# EasyEDA Pro project LEAP_ROS.epro, schematic LEAP_ROS

## Sheets
1 P1: Assembly Variant: Basic; Board Name: Board1; Create Date: 2026-04-24; Page Name: P1; Project Name: 四驱v2核心板; Schematic Name: Schematic1; Update Date: 2026-04-24; Company: 嘉立创EDA; Page Size: A4; Version: V1.0
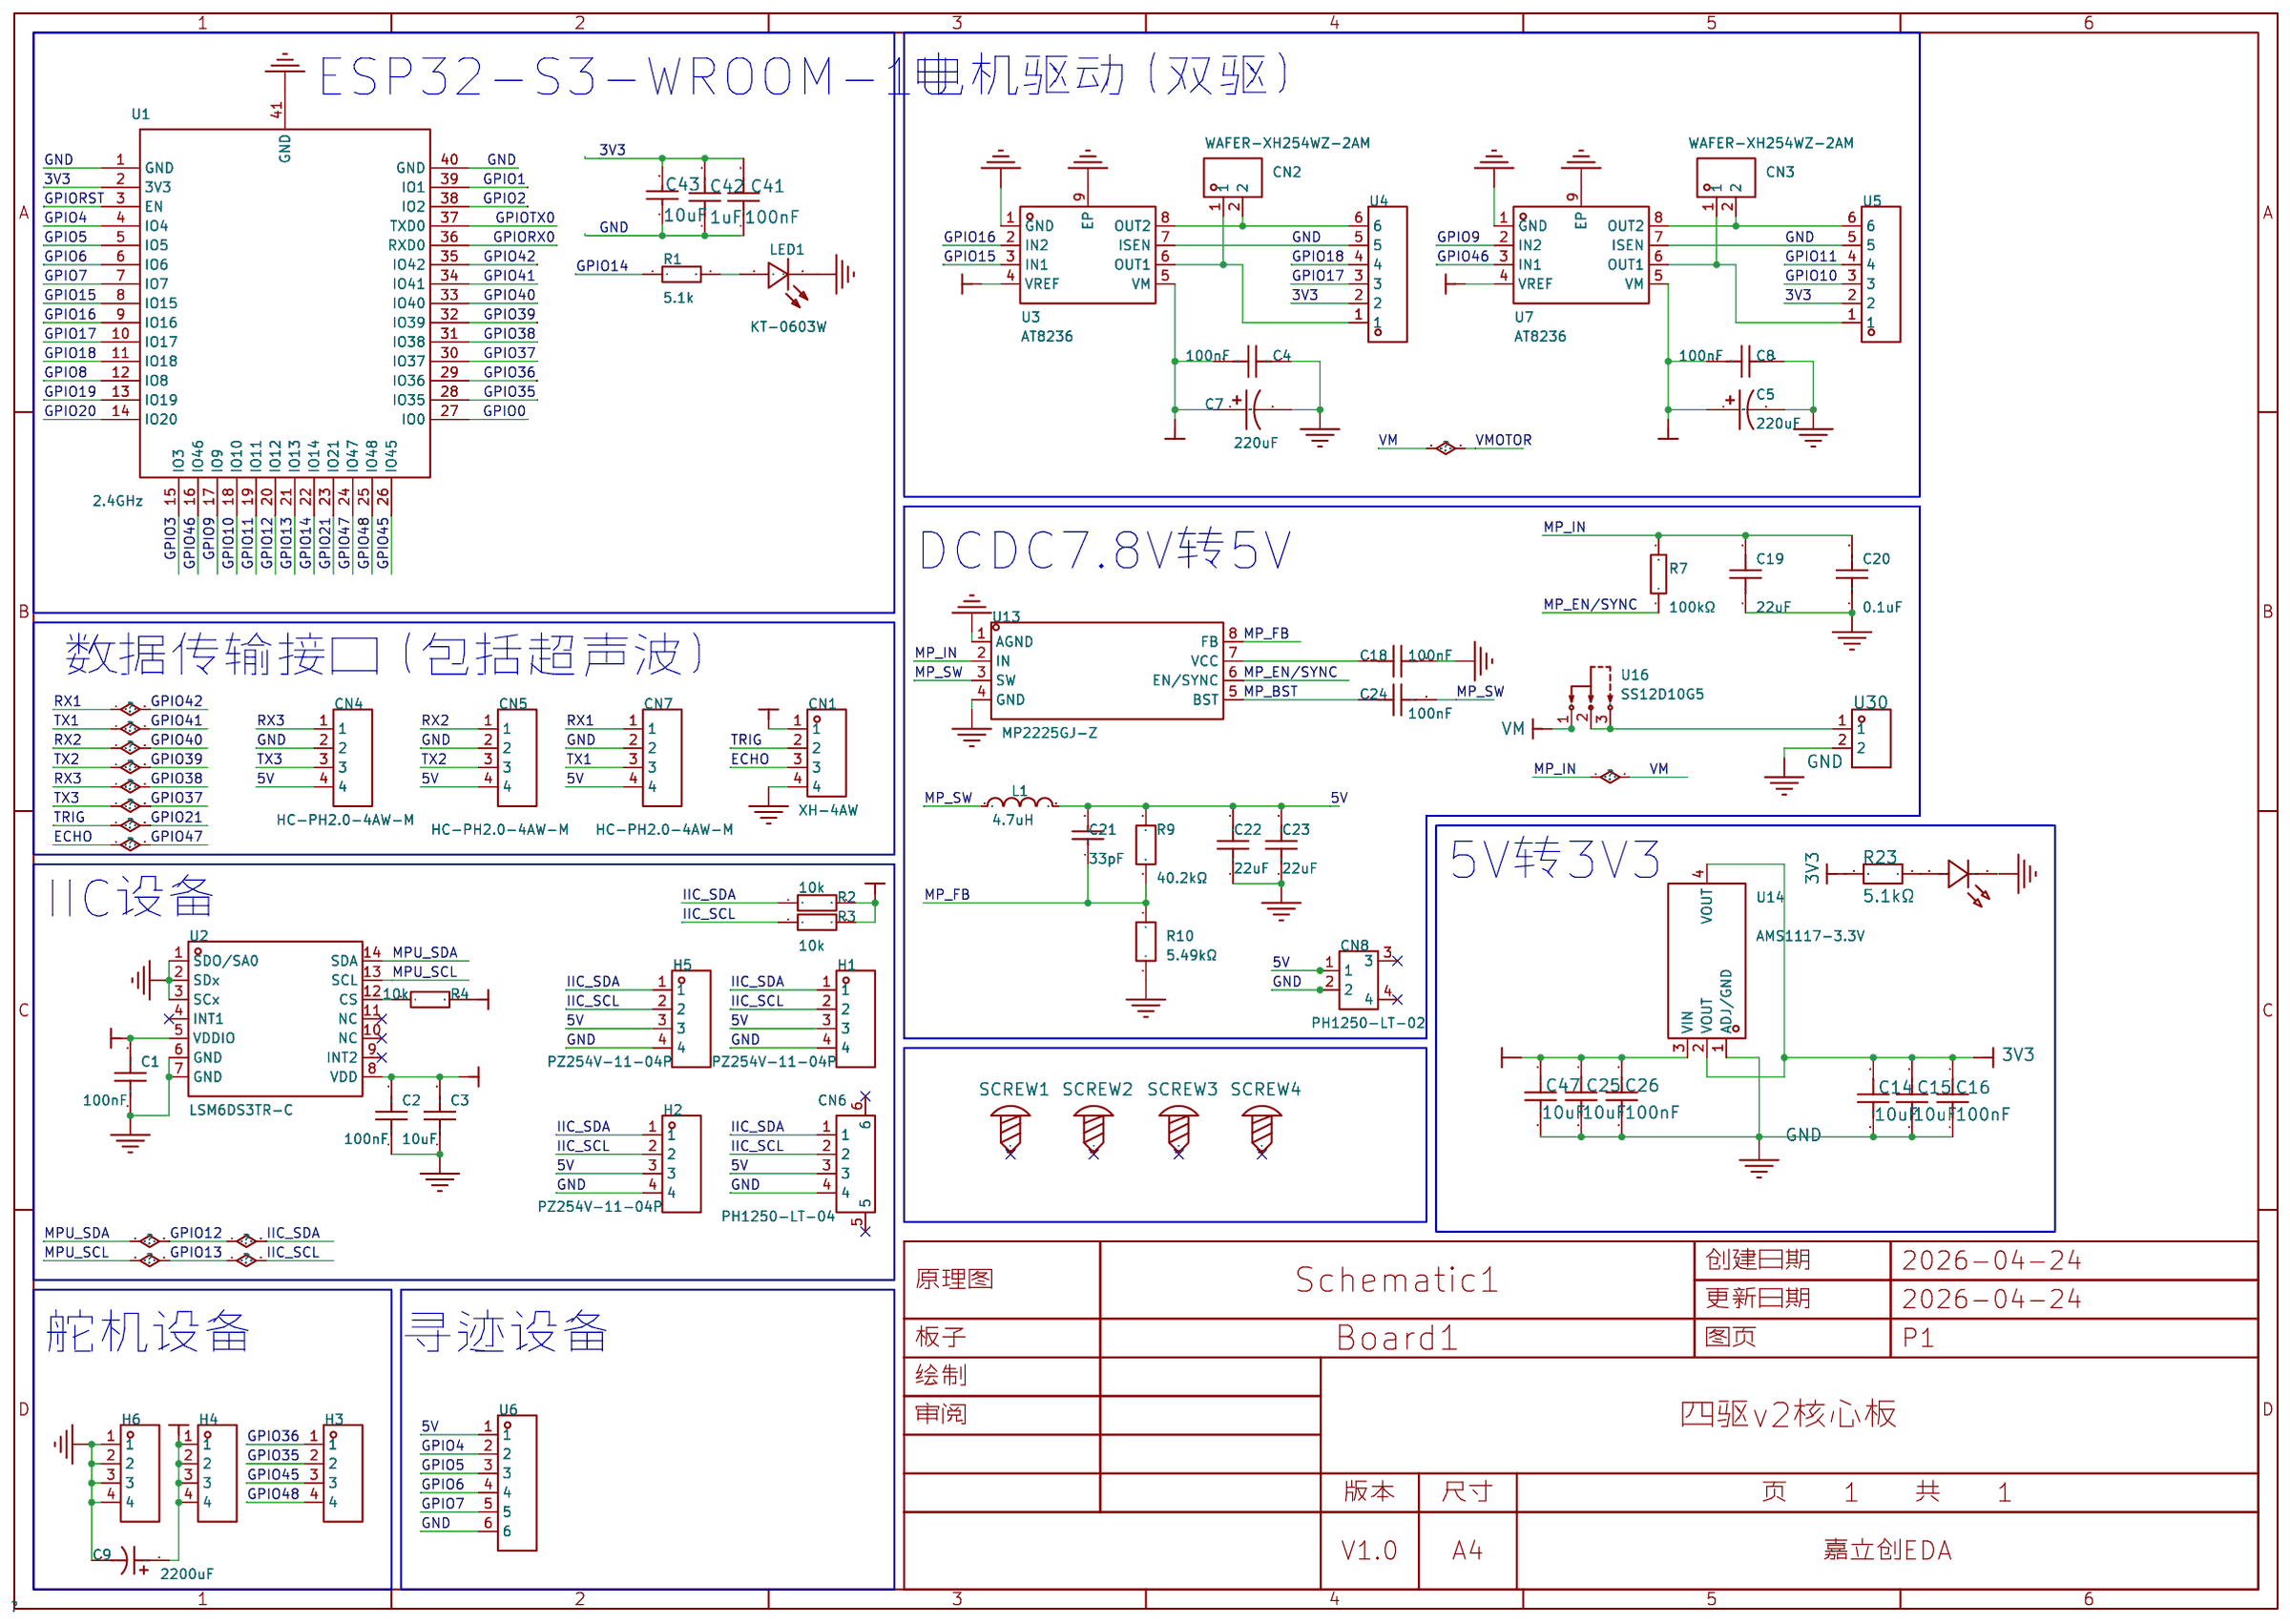
[diagram p0: P1]
2 P2: Page Name: P2
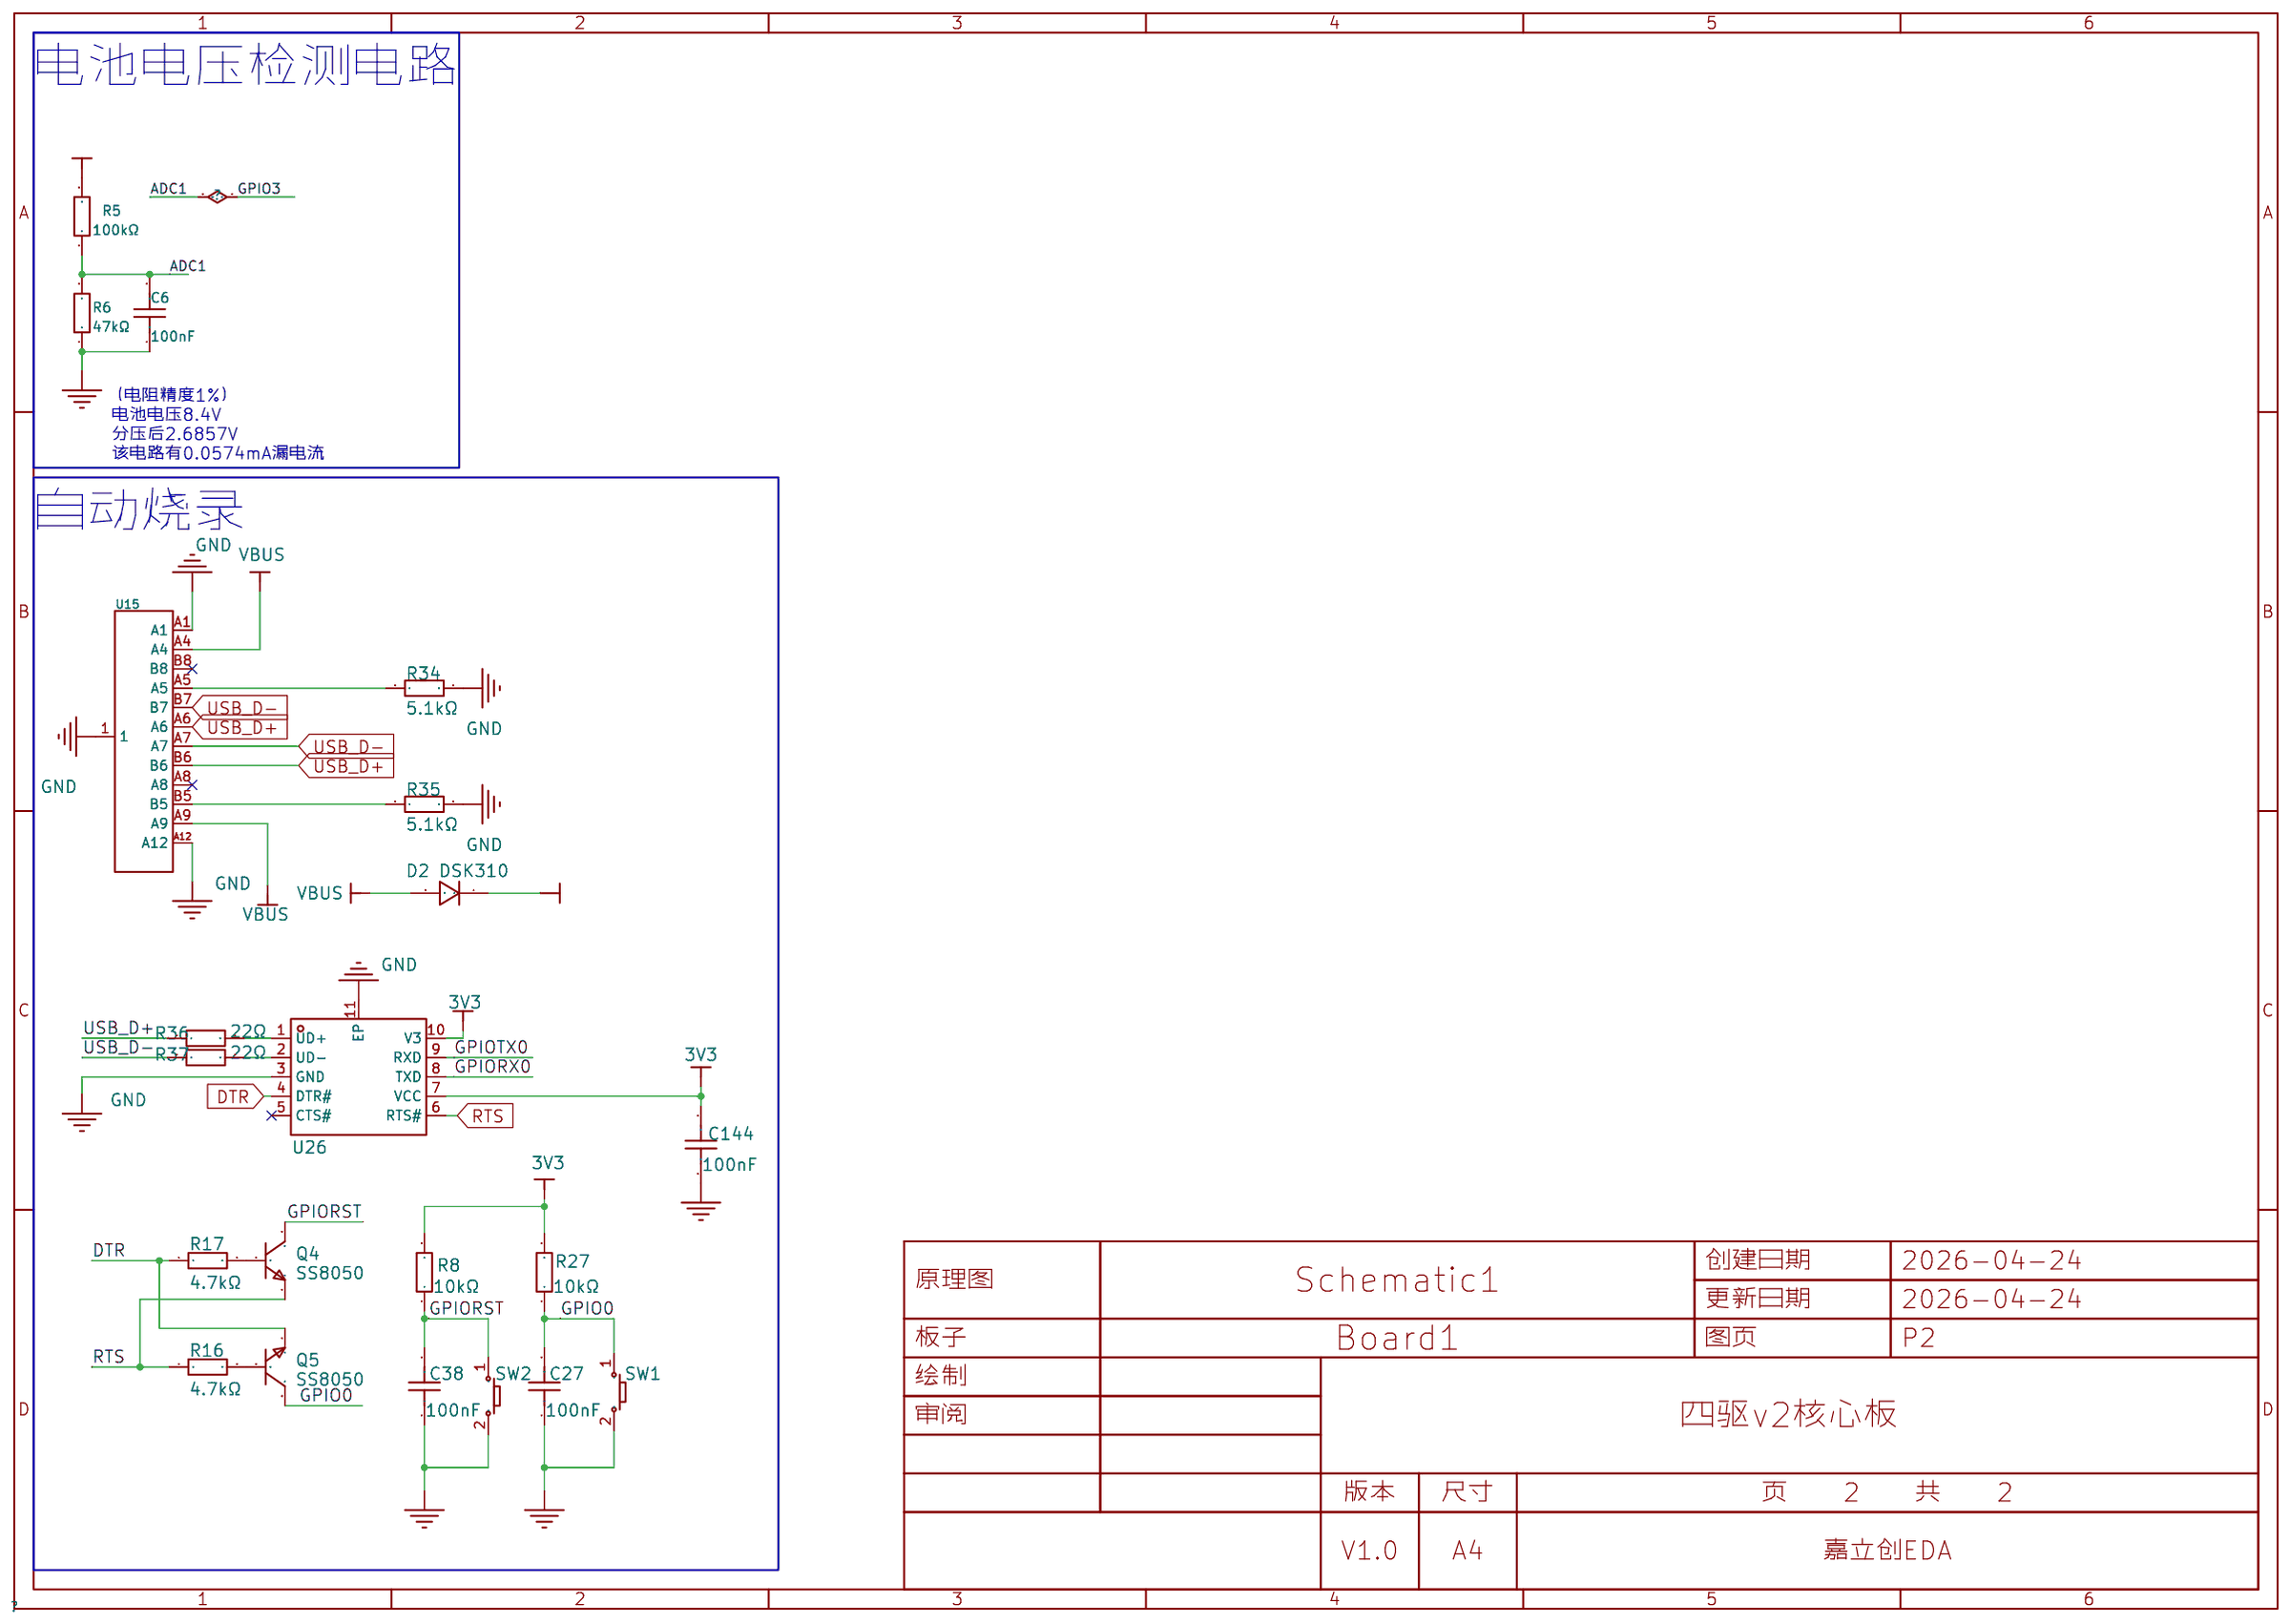
[diagram p1: P2]

## Parts
sheet P1
C1  100nF  [C0603]
C2  100nF  [C0603]
C3  10uF  [C0603]
C4  100nF  [C0603]
C5  220uF  [CAP-TH_BD6.3-P2.50-D0.6-FD-1]
C7  220uF  [CAP-TH_BD6.3-P2.50-D0.6-FD-1]
C8  100nF  [C0603]
C9  2200uF  [CAP-TH_BD10.0-P5.00-D0.6-FD]
C14  10uF  [C0603]
C15  10uF  [C0603]
C16  100nF  [C0603]
C18  100nF  [C0603]
C19  22uF  [C0603]
C20  0.1uF  [C0603]
C21  33pF  [C0603]
C22  22uF  [C0603]
C23  22uF  [C0603]
C24  100nF  [C0603]
C25  10uF  [C0603]
C26  100nF  [C0603]
C41  100nF  [C0603]
C42  1uF  [C0603]
C43  10uF  [C0603]
C47  10uF  [C0603]
CN1  XH-4AW  [CONN-TH_XH-4AW]
CN2  WAFER-XH254WZ-2AM  [CONN-TH_2P-P2.50_WAFER-XH254WZ-2A]
CN3  WAFER-XH254WZ-2AM  [CONN-TH_2P-P2.50_WAFER-XH254WZ-2A]
CN4  HC-PH2.0-4AW-M  [CONN-TH_HC-PH2.0-4AW-M]
CN5  HC-PH2.0-4AW-M  [CONN-TH_HC-PH2.0-4AW-M]
CN6  PH1250-LT-04  [CONN-SMD_PH1250-LT-04]
CN7  HC-PH2.0-4AW-M  [CONN-TH_HC-PH2.0-4AW-M]
CN8  PH1250-LT-02  [CONN-SMD_2P-P1.25_PH1250-LT-02]
H1  PZ254V-11-04P  [HDR-TH_4P-P2.54-V-M]
H2  PZ254V-11-04P  [HDR-TH_4P-P2.54-V-M]
H3  PZ254V-11-04P  [HDR-TH_4P-P2.54-V-M]
H4  PZ254V-11-04P  [HDR-TH_4P-P2.54-V-M]
H5  PZ254V-11-04P  [HDR-TH_4P-P2.54-V-M]
H6  PZ254V-11-04P  [HDR-TH_4P-P2.54-V-M]
L1  4.7uH  [IND-SMD_L7.0-W6.6]
LED1  KT-0603W  [LED0603-R-RD_WHITE]
LED5  XL-1608SURC-06  [LED0603-RD_RED]
R1  5.1k  [R0603]
R2  10k  [R0603]
R3  10k  [R0603]
R4  10k  [R0603]
R7  100kΩ  [R0603]
R9  40.2kΩ  [R0603]
R10  5.49kΩ  [R0603]
R23  5.1kΩ  [R0603]
SCREW1  -  [M2螺丝]
SCREW2  -  [M2螺丝]
SCREW3  -  [M2螺丝]
SCREW4  -  [M2螺丝]
U1  2.4GHz  [WIRELM-SMD_ESP32-S3-WROOM-1U]
U2  LSM6DS3TR-C  [LGA-14_L3.0-W2.5-P0.50-TL]
U3  AT8236  [ESOP-8_L4.9-W3.9-P1.27-LS6.0-BL-EP]
U4  ZX-XH2.54-6PWZ  [CONN-TH_6P-P2.50_ZX-XH2.54-6PWZ]
U5  ZX-XH2.54-6PWZ  [CONN-TH_6P-P2.50_ZX-XH2.54-6PWZ]
U6  ZX-XH2.54-6PWZ  [CONN-TH_6P-P2.50_ZX-XH2.54-6PWZ]
U7  AT8236  [ESOP-8_L4.9-W3.9-P1.27-LS6.0-BL-EP]
U13  MP2225GJ-Z  [TSOT-23-8_L2.9-W1.6-P0.65-LS2.8-BR]
U14  AMS1117-3.3V  [SOT-223-4_L6.5-W3.5-P2.30-LS7.0-TR]
U16  SS12D10G5  [SW-TH_SHOU-HAN_SS12D10G4]
U30  KH-A2504-02AW  [CONN-TH_2P-P2.50_KH-A2504-02AW]
sheet P2
C6  100nF  [C0603]
C27  100nF  [C0603]
C38  100nF  [C0603]
C144  100nF  [C0603]
D2  DSK310  [SOD-123FL_L2.8-W1.9-LS3.7-RD]
Q4  SS8050  [SOT-23-3_L2.9-W1.3-P1.90-LS2.4-BR]
Q5  SS8050  [SOT-23-3_L2.9-W1.3-P1.90-LS2.4-BR]
R5  100kΩ  [R0603]
R6  47kΩ  [R0603]
R8  10kΩ  [R0603]
R16  4.7kΩ  [R0603]
R17  4.7kΩ  [R0603]
R27  10kΩ  [R0603]
R34  5.1kΩ  [R0603]
R35  5.1kΩ  [R0603]
R36  22Ω  [R0603]
R37  22Ω  [R0603]
SW1  TSA016A2518A  [KEY-SMD_4P-L4.2-W3.4-P2.15-LS4.5-TL]
SW2  TSA016A2518A  [KEY-SMD_4P-L4.2-W3.4-P2.15-LS4.5-TL]
U15  USB-TYPE-C-019  [TYPE-C-SMD_HX-TYPE-C-16PIN]
U26  CH340K  [ESOP-10_L4.9-W3.9-P1.00-LS6.2-BL-EP]

## Library data of the parts
C1-C4 C6 C8 C18-C20 C24 = CGA0603X7R104K500JT: 容值:100nF;精度:±10%;额定电压:50V;温度系数:X7R;; LCSC Part Name: 100nF ±10% 50V; Supplier Part: C6119867; Manufacturer: HRE(芯声); Supplier Footprint: 0603; JLCPCB Part Class: Extended Part; Datasheet: https://item.szlcsc.com/datasheet/CGA0603X7R104K500JT/7062573.html; Supplier: LCSC; Tolerance: ±10%; Voltage Rating: 50V; Temperature Coefficient: X7R
C5 C7 = KNH2220UF35V149EC0020: 容值:220uF;精度:±20%;额定电压:35V;纹波电流:1.7A@100kHz;等效串联电阻(ESR):40mΩ@100kHz;; LCSC Part Name: 220uF ±20% 35V; Supplier Part: C2944314; Manufacturer: KNSCHA(科尼盛); Supplier Footprint: 插件,D6.3xL12mm; JLCPCB Part Class: Extended Part; Datasheet: https://item.szlcsc.com/datasheet/KNH2220UF35V149EC0020/3330329.html; Supplier: LCSC; Tolerance: ±20%; Voltage Rating: 35V; Ripple Current: 1.7A@100kHz; Equivalent Series Resistance(ESR): 40mΩ@100kHz; Pin Spacing: 2.5mm; Diameter: 6.3mm; Height - Seated (Max): 12mm; Lifetime: 2000hrs@105℃; Operating Temperature: -55℃~+105℃
C9 = ERA10V2200M10X16: 容值:2200uF;精度:±20%;额定电压:10V;纹波电流:886mA@120Hz;; LCSC Part Name: 2200uF ±20% 10V; Supplier Part: C49256788; Manufacturer: JIERR(捷而瑞); Supplier Footprint: 插件,D10xL16mm; JLCPCB Part Class: Extended Part; Datasheet: https://item.szlcsc.com/datasheet/ERA10V2200M10X16/51692188.html; Supplier: LCSC; Tolerance: ±20%; Voltage Rating: 10V; Ripple Current: 886mA@120Hz; Pin Spacing: 5mm; Diameter: 10mm; Height - Seated (Max): 16mm; Lifetime: 2000hrs@105℃; Operating Temperature: -40℃~+105℃
C14 C15 C25 C47 = CL10A106MA8NRNC: LCSC Part Name: 10uF ±20% 25V; Supplier Part: C96446; Manufacturer: SAMSUNG(三星); Supplier Footprint: 0603; JLCPCB Part Class: Basic Part; Datasheet: https://atta.szlcsc.com/upload/public/pdf/source/20160218/1457707763339.pdf; Supplier: LCSC; Tolerance: ±20%; Voltage Rated: 25V; Temperature Coefficient: X5R
C16 C26 C41 C144 = CGA0603X7R104K500JT: LCSC Part Name: 100nF ±10% 50V; Supplier Part: C6119867; Manufacturer: HRE(芯声); Supplier Footprint: 0603; JLCPCB Part Class: Extended Part; Datasheet: https://atta.szlcsc.com/upload/public/pdf/source/20250103/C44077DA9E7B3EFAE02F22B6D3D1CBC9.pdf; Supplier: LCSC; Tolerance: ±10%; Voltage Rating: 50V; Temperature Coefficient: X7R
C21 = CC0603JRNPO9BN330: 容值:33pF;精度:±5%;额定电压:50V;温度系数:NP0;; LCSC Part Name: 33pF ±5% 50V; Supplier Part: C107047; Manufacturer: YAGEO(国巨); Supplier Footprint: 0603; JLCPCB Part Class: Extended Part; Datasheet: https://item.szlcsc.com/datasheet/CC0603JRNPO9BN330/108263.html; Supplier: LCSC; Tolerance: ±5%; Voltage Rating: 50V; Temperature Coefficient: NP0
C22 C23 = CGA0603X5R226M160JT: 容值:22uF;精度:±20%;额定电压:16V;温度系数:X5R;; LCSC Part Name: 22uF ±20% 16V; Supplier Part: C6119868; Manufacturer: HRE(芯声); Supplier Footprint: 0603; JLCPCB Part Class: Extended Part; Datasheet: https://item.szlcsc.com/datasheet/CGA0603X5R226M160JT/7062574.html; Supplier: LCSC; Tolerance: ±20%; Voltage Rating: 16V; Temperature Coefficient: X5R
C42 = CAP_0603: Supplier Footprint: 0603
C43 = CL10A106MO8NQNC: LCSC Part Name: 10uF ±20% 16V; Supplier Part: C92487; Manufacturer: SAMSUNG(三星); Supplier Footprint: 0603; JLCPCB Part Class: 扩展库; Datasheet: https://item.szlcsc.com/datasheet/CL10A106MO8NQNC/93680.html; Supplier: LCSC; Tolerance: ±20%; Voltage Rating: 16V; Temperature Coefficient: X5R
CN1 = XH-4AW: 插针结构:1x4P;间距:2.54mm;安装方式:弯插;参考系列:XH;总PIN数:4P;排数:1;每排PIN数:4;行距:-;额定电流:3A;触头材质:黄铜;触头镀层:锡;工作温度:-25℃~+85℃;; LCSC Part Name: 1x4P 间距:2.54mm 弯插 系列:XH; Supplier Part: C2908613; Manufacturer: HCTL(华灿天禄); Supplier Footprint: 弯插,P=2.5mm; JLCPCB Part Class: Extended Part; Datasheet: https://item.szlcsc.com/datasheet/XH-4AW/3184384.html; Supplier: LCSC; Pins Structure: 1x4P; Pitch: 2.54mm; Mounting Type: 弯插; Reference Series: XH; Number of Pins: 4P; Number of Rows: 1; Number of PINs Per Row: 4; Current Rating: 3A; Contact Material: 黄铜; Contact Plating: 锡; Operating Temperature: -25℃~+85℃; Voltage Rating: 250V; Plastic Material: PA66; Flame Retardant Rating: UL94V-0; Z-Height of the Board: 5.9mm; Y-Width of Bottom Edge on Board: 7mm
CN2 CN3 = WAFER-XH254WZ-2AM: 插针结构:1x2P;间距:2.54mm;安装方式:弯插;参考系列:XH;总PIN数:2P;排数:1;每排PIN数:2;额定电流:3A;触头材质:黄铜;工作温度:-25℃~+85℃;; LCSC Part Name: 1x2P 间距:2.54mm 弯插 系列:XH; Supplier Part: C22751831; Manufacturer: HANBO(汉博); Supplier Footprint: 弯插,P=2.54mm; JLCPCB Part Class: Extended Part; Datasheet: https://item.szlcsc.com/datasheet/WAFER-XH254WZ-2AM/24478766.html; Supplier: LCSC; Pins Structure: 1x2P; Pitch: 2.54mm; Mounting Type: 弯插; Reference Series: XH; Number of Pins: 2P; Number of Rows: 1; Number of PINs Per Row: 2; Current Rating: 3A; Contact Material: 黄铜; Operating Temperature: -25℃~+85℃; Voltage Rating: 250V; Plastic Material: PA66; Flame Retardant Rating: UL94V-0
CN4 CN5 CN7 = HC-PH2.0-4AW-M: 插针结构:1x4P;间距:2mm;安装方式:弯插;参考系列:PH;总PIN数:4P;排数:1;每排PIN数:4;额定电流:1A;触头材质:铜;触头镀层:锡;工作温度:-25℃~+85℃;; LCSC Part Name: 1x4P 间距:2mm 弯插 系列:PH; Supplier Part: C53454740; Manufacturer: HC(虹成电子); Supplier Footprint: 弯插,P=2mm; JLCPCB Part Class: Extended Part; Datasheet: https://item.szlcsc.com/datasheet/HC-PH2.0-4AW-M/56613746.html; Supplier: LCSC; Pins Structure: 1x4P; Pitch: 2mm; Mounting Type: 弯插; Reference Series: PH; Number of Pins: 4P; Number of Rows: 1; Number of PINs Per Row: 4; Current Rating: 1A; Contact Material: 铜; Contact Plating: 锡; Operating Temperature: -25℃~+85℃; Voltage Rating: 250V; Plastic Material: PA66; Color: 米色; Z-Height of the Board: 4.8mm; X-Length of Bottom Edge on Board (Spacing Line): 10mm; Y-Width of Bottom Edge on Board: 6.1mm
CN6 = PH1250-LT-04: 插针结构:1x4P;间距:1.25mm;安装方式:立贴;参考系列:PH;总PIN数:4P;排数:1;每排PIN数:4;行距:-;额定电流:-;触头材质:黄铜;触头镀层:锡;工作温度:-;; LCSC Part Name: 1x4P 间距:1.25mm 立贴 系列:PH; Supplier Part: C2939428; Manufacturer: HOOYA(皓宇电子); Supplier Footprint: SMD,P=1.25mm; JLCPCB Part Class: Extended Part; Datasheet: https://item.szlcsc.com/datasheet/PH1250-LT-04/3300375.html; Supplier: LCSC; Pins Structure: 1x4P; Pitch: 1.25mm; Mounting Type: 立贴; Reference Series: PH; Number of Pins: 4P; Number of Rows: 1; Number of PINs Per Row: 4; Contact Material: 黄铜; Contact Plating: 锡; Plastic Material: LCP; Color: 米色; Z-Height of the Board: 5.5mm; X-Length of Bottom Edge on Board (Spacing Line): 9.8mm; Y-Width of Bottom Edge on Board: 3.92mm
CN8 = PH1250-LT-02: 插针结构:1x2P;间距:1.25mm;安装方式:立贴;参考系列:PH;总PIN数:2P;排数:1;每排PIN数:2;行距:-;额定电流:-;触头材质:黄铜;触头镀层:锡;工作温度:-;; LCSC Part Name: 1x2P 间距:1.25mm 立贴 系列:PH; Supplier Part: C2939426; Manufacturer: HOOYA(皓宇电子); Supplier Footprint: SMD,P=1.25mm; JLCPCB Part Class: Extended Part; Datasheet: https://item.szlcsc.com/datasheet/PH1250-LT-02/3300373.html; Supplier: LCSC; Pins Structure: 1x2P; Pitch: 1.25mm; Mounting Type: 立贴; Reference Series: PH; Number of Pins: 2P; Number of Rows: 1; Number of PINs Per Row: 2; Contact Material: 黄铜; Contact Plating: 锡; Plastic Material: LCP; Color: 米色; Z-Height of the Board: 5.5mm; X-Length of Bottom Edge on Board (Spacing Line): 7.3mm; Y-Width of Bottom Edge on Board: 3.92mm
H1-H6 = PZ254V-11-04P: 插针结构:1x4P;间距:2.54mm;行距:-;圆针/方针:方针;安装方式:直插;排数:单排;总PIN位数:4P;额定电流:3A;额定电压:250V;配合针长度:6mm;塑高:2.5mm;端接针长度:3mm;触头材质:-;工作温度:-40℃~+105℃;颜色:黑色;; LCSC Part Name: 1x4P 间距:2.54mm 方针 直插; Supplier Part: C2691448; Manufacturer: XFCN(兴飞); Supplier Footprint: 插件,P=2.54mm; JLCPCB Part Class: Extended Part; Datasheet: https://item.szlcsc.com/datasheet/PZ254V-11-04P/2801085.html; Supplier: LCSC; Pin Structure: 1x4P; Pitch: 2.54mm; Circluar Pins/Square Pins: 方针; Mounting Type: 直插; Number of Rows: 单排; Number of Pins: 4P; Current Rating: 3A; Voltage Rating (Max): 250V; Length of Mating Pin: 6mm; Insulation Height: 2.5mm; Length of End Connection Pin: 3mm; Operating Temperature: -40℃~+105℃; Color: 黑色
L1 = MWSA0605S-4R7MT: 电感值:4.7uH;精度:±20%;额定电流:6A;饱和电流(Isat):8A;类型:-;; LCSC Part Name: 4.7uH ±20% 8A; Supplier Part: C408465; Manufacturer: Sunlord(顺络); Supplier Footprint: SMD,7x6.6mm; JLCPCB Part Class: Extended Part; Datasheet: https://item.szlcsc.com/datasheet/MWSA0605S-4R7MT/397817.html; Supplier: LCSC; Tolerance: ±20%; Current Rating: 6A; Current - Saturation(Isat): 8A; DC Resistance(DCR): 29mΩ
LED1 = KT-0603W: 灯头类型:-;发光颜色:白色;正向压降(Vf):2.6V~3.1V;功率:100mW;正向电流:5mA;波长:-;二极管配置:独立二极管;透镜颜色:黄色透镜;色温:-;发光强度:360mcd;发光角度:120°;载带方式:正贴;工作温度:-40℃~+85℃;; LCSC Part Name: 0603 白灯 高亮; Supplier Part: C2290; Manufacturer: KENTO; Supplier Footprint: 0603; JLCPCB Part Class: Basic Part; Datasheet: https://item.szlcsc.com/datasheet/KT-0603W/2663.html; Supplier: LCSC; Illumination Color: 白色; Voltage - Forward(Vf): 2.6V~3.1V; Power(Watts): 100mW; Forward Current: 5mA; Diode Configuration: 独立二极管; Lens Color: 黄色透镜; Luminous Intensity: 360mcd; Viewing Angle: 120°; Mounting Style: 正贴; Operating Temperature: -40℃~+85℃
LED5 = XL-1608SURC-06: Supplier Part: C965799; Manufacturer: XINGLIGHT(成兴光); Supplier Footprint: 0603; Datasheet: https://atta.szlcsc.com/upload/public/pdf/source/20250213/F9766CE804AF391355DCDD48DB3E0DAB.pdf; Supplier: LCSC; Illumination Color: 红色; Voltage - Forward(Vf): 2.3V; Power(Watts): 50mW; Forward Current: 20mA; Wavelength - Dominant: 620nm~630nm; Peak Wavelength: 625nm; Lens Color: 无色透明透镜; Luminous Intensity: 225mcd; Viewing Angle: 120°; Mounting Sytle: 正贴; Operating Temperature: -20℃~+85℃
R1-R4 = Res_0603: Supplier Footprint: 0603
R5 R7 = 0603WAF1003T5E: 电阻类型:厚膜电阻;阻值:100kΩ;精度:±1%;功率:100mW;工作电压:75V;温度系数:±100ppm/℃;; LCSC Part Name: 100kΩ ±1% 100mW 厚膜电阻; Supplier Part: C25803; Manufacturer: UNI-ROYAL(厚声); Supplier Footprint: 0603; JLCPCB Part Class: Basic Part; Datasheet: https://item.szlcsc.com/datasheet/0603WAF1003T5E/26546.html; Supplier: LCSC; Type: 厚膜电阻; Tolerance: ±1%; Power(Watts): 100mW; Voltage-Supply(Max): 75V; Temperature Coefficient: ±100ppm/℃; Operating Temperature: -55℃~+155℃
R9 = FRC0603F4022TS: 电阻类型:厚膜电阻;阻值:40.2kΩ;精度:±1%;功率:100mW;工作电压:75V;温度系数:±100ppm/℃;; LCSC Part Name: 40.2kΩ ±1% 100mW 厚膜电阻; Supplier Part: C2933218; Manufacturer: FOJAN(富捷); Supplier Footprint: 0603; JLCPCB Part Class: Extended Part; Supplier: LCSC; Type: 厚膜电阻; Tolerance: ±1%; Power(Watts): 100mW; Voltage-Supply(Max): 75V; Temperature Coefficient: ±100ppm/℃; Operating Temperature: -55℃~+155℃
R10 = FRC0603F5491TS: 电阻类型:厚膜电阻;阻值:5.49kΩ;精度:±1%;功率:100mW;工作电压:75V;温度系数:±100ppm/℃;; LCSC Part Name: 5.49kΩ ±1% 100mW 厚膜电阻; Supplier Part: C3000723; Manufacturer: FOJAN(富捷); Supplier Footprint: 0603; JLCPCB Part Class: Extended Part; Supplier: LCSC; Type: 厚膜电阻; Tolerance: ±1%; Power(Watts): 100mW; Voltage-Supply(Max): 75V; Temperature Coefficient: ±100ppm/℃; Operating Temperature: -55℃~+155℃
R23 = FRC0603F5101TS: LCSC Part Name: 5.1kΩ ±1% 100mW 厚膜电阻; Supplier Part: C2907044; Manufacturer: FOJAN(富捷); Supplier Footprint: 0603; JLCPCB Part Class: 扩展库; Datasheet: https://item.szlcsc.com/datasheet/FRC0603F5101TS/3180557.html; Supplier: LCSC; Type: 厚膜电阻; Tolerance: ±1%; Power(Watts): 100mW; Voltage-Supply(Max): 75V; Temperature Coefficient: ±100ppm/℃; Operating Temperature: -55℃~+155℃
SCREW1-SCREW4 = M2螺丝: Supplier Footprint: 插件
U1 = ESP32-S3-WROOM-1U-N4: 核心芯片:ESP32-S3;频率:2.4GHz;发射功率:20.5dBm;接收灵敏度:-103.5dBm;; LCSC Part Name: 不带固件 通用型Wi-Fi+低功耗蓝牙MCU模组; Supplier Part: C2980296; Manufacturer: ESPRESSIF(乐鑫); Supplier Footprint: SMD,19.2x18mm; JLCPCB Part Class: Extended Part; Datasheet: https://item.szlcsc.com/datasheet/ESP32-S3-WROOM-1U-N4/3401548.html; Supplier: LCSC; Utilized IC / Part: ESP32-S3; Wireless Standard: Bluetooth5.0; Interface Type: I2C；UART；SPI；USB；I2S; Output Power: 20.5dBm; Voltage - Supply: 3V~3.6V; Receive  Current: 95mA; Send  Current: 355mA; Sensitivity: -103.5dBm; Operating Temperature: -40℃~+85℃
U2 = LSM6DS3TR-C: 传感器类型:加速度计陀螺仪;接口类型:I2C；SPI;; LCSC Part Name: IMU-惯性测量单元; Supplier Part: C967633; Manufacturer: ST(意法半导体); Supplier Footprint: LGA-14(2.5x3); JLCPCB Part Class: Extended Part; Datasheet: https://item.szlcsc.com/datasheet/LSM6DS3TR-C/1054343.html; Supplier: LCSC; Accelerometer Sensing Axis: X,Y,Z; Acceleration Measurement Range (MAX): ±16g; Gyroscope Sensing Axis: X,Y,Z; Gyroscope Measurement Range (MAX): ±2000dps; Sensor Type: 加速度计陀螺仪; Interface: I2C；SPI; Voltage - Supply: 1.71V~3.6V; Cache Size: 4KB; Operating Temperature: -40℃~+85℃
U3 U7 = AT8236: AT8236是一款直流有刷电机驱动器，能够以高达6A的峰值电流双向控制电机。利用电流衰减模式，可通过对输入信号进行脉宽调制(PWM) 来控制电机转速，同时具备低功耗休眠模式。 AT8236集成同步整流功能，可显著降低系统功耗要求。; LCSC Part Name: 单通道直流有刷电机驱动芯片; Supplier Part: C2827823; Manufacturer: 杭州中科微; Supplier Footprint: ESOP-8; JLCPCB Part Class: Extended Part; Datasheet: https://item.szlcsc.com/datasheet/AT8236/2974744.html; Supplier: LCSC; Number of H-bridges: 1; Output Current: 3A; Peak Current: 6A; RDS(on): 200mΩ; Quiescent Current(Iq): 20uA; Operating Temperature: -40℃~+85℃
U4-U6 = ZX-XH2.54-6PWZ: 插针结构:1x6P;间距:2.5mm;安装方式:弯插;参考系列:XH;总PIN数:6P;排数:1;每排PIN数:6;行距:-;额定电流:2A;触头材质:黄铜;触头镀层:锡;工作温度:-25℃~+85℃;; LCSC Part Name: 1x6P 间距:2.5mm 弯插 系列:XH; Supplier Part: C7429645; Manufacturer: Megastar(兆星); Supplier Footprint: 弯插,P=2.5mm; JLCPCB Part Class: Extended Part; Datasheet: https://item.szlcsc.com/datasheet/ZX-XH2.54-6PWZ/8427562.html; Supplier: LCSC; Pins Structure: 1x6P; Pitch: 2.5mm; Mounting Type: 弯插; Reference Series: XH; Number of Pins: 6P; Number of Rows: 1; Number of PINs Per Row: 6; Current Rating: 2A; Contact Material: 黄铜; Contact Plating: 锡; Operating Temperature: -25℃~+85℃; Voltage Rating: 250V; Plastic Material: PA66; Flame Retardant Rating: UL94V-0; Color: 白色; Z-Height of the Board: 5.9mm; X-Length of Bottom Edge on Board (Spacing Line): 17.5mm; Y-Width of Bottom Edge on Board: 7.32mm
U13 = MP2225GJ-Z_C133066: 功能类型:降压型;输出类型:可调;工作电压:4.5V~18V;输出电压:600mV~18V;输出电流:5A;; LCSC Part Name: 高效率5A 18V同步降压转换器; Supplier Part: C133066; Manufacturer: MPS(芯源); Supplier Footprint: TSOT-23-8; JLCPCB Part Class: Extended Part; Datasheet: https://item.szlcsc.com/datasheet/MP2225GJ-Z/144368.html; Supplier: LCSC; Function: 降压型; Output Type: 可调; Voltage - Supply: 4.5V~18V; Output Voltage: 600mV~18V; Output Current: 5A; Frequency - Switching: 500kHz; Operating Temperature: -40℃~+125℃@(TJ); Synchronous Rectifier: 是; Number of Outputs: 1; Topology: 降压式; Quiescent Current: 320uA; Switch tube (built-in/external): 内置
U14 = AMS1117-3.3V: 输出类型:固定;工作电压:12V;输出电压:3.3V;输出电流:1A;输出极性:正极;; LCSC Part Name: 3.3V 1A 12V; Supplier Part: C5120765; Manufacturer: MSKSEMI(美森科); Supplier Footprint: SOT-223; JLCPCB Part Class: Extended Part; Datasheet: https://item.szlcsc.com/datasheet/AMS1117-3.3V/5706124.html; Supplier: LCSC; Output Type: 固定; Voltage - Supply: 12V; Output Voltage: 3.3V; Output Current: 1A; Voltage Dropout: 1.4V@(1A); standby current: 12mA; Features: 过流保护；过热保护; Operating Temperature: 0℃~+125℃@(Ta); Output Configuration: 正极; Number of Outputs: 1
U16 = SS12D10G5: 电路结构:单刀双掷;安装方式:直插;额定电流:2A;额定电压:125V;工作寿命:3千次;; LCSC Part Name: SS12D10G5-7.0; Supplier Part: C7431054; Manufacturer: SHOU HAN(首韩); Supplier Footprint: 插件,12.7x6.7mm; JLCPCB Part Class: Extended Part; Datasheet: https://item.szlcsc.com/datasheet/SS12D10G5/8431406.html; Supplier: LCSC; Circuit: 单刀双掷; Length: 12.7mm; Width: 6.7mm; Mounting Type: 直插; Current Rating: 2A; Voltage Rating: 125V; Life: 3千次; Operating Temperature: -25℃~+70℃
U30 = KH-A2504-02AW: LCSC Part Name: 白色 1x2P 间距:2.54mm 弯插; Supplier Part: C18186388; Manufacturer: kinghelm(金航标); Supplier Footprint: 插件,P=2.5mm; Datasheet: https://item.szlcsc.com/datasheet/KH-A2504-02AW/19335255.html; Supplier: LCSC; Pins Structure: 1x2P; Pitch: 2.54mm; Mounting Type: 弯插; Number of Pins: 2P; Number of Rows: 1; Number of PINs Per Row: 2
C27 C38 = CC0603KRX7R9BB104: LCSC Part Name: 100nF ±10% 50V; Supplier Part: C14663; Manufacturer: YAGEO(国巨); Supplier Footprint: 0603; JLCPCB Part Class: 基础库; Datasheet: https://atta.szlcsc.com/upload/public/pdf/source/20180910/C282072_33301C7F631E79921B82A8DAC6BCC5B3.pdf; Supplier: LCSC; Tolerance: ±10%; Voltage Rated: 50V; Temperature Coefficient: X7R
D2 = DSK310_C28646289: LCSC Part Name: 电压:100V 电流:3A; Supplier Part: C28646289; Manufacturer: R+O(宏嘉诚); Supplier Footprint: SOD-123FL; Datasheet: https://item.szlcsc.com/datasheet/DSK310/30381035.html; Supplier: LCSC; Diode Configuration: 1个独立式; Voltage - Forward(Vf@If): 850mV@3A; Voltage - DC Reverse(Vr): 100V; Current - Rectified: 3A; Reverse Leakage Current (Ir): 50uA@100V; Operating Junction Temperature Range: -55℃~+150℃; Non-Repetitive Peak Forward Surge Current: 80A
Q4 Q5 = SS8050_C7420370: LCSC Part Name: H档 200-350; Supplier Part: C7420370; Manufacturer: 宏嘉诚; Supplier Footprint: SOT-23; JLCPCB Part Class: 扩展库; Datasheet: https://atta.szlcsc.com/upload/public/pdf/source/20250205/5DB94E86981B5B1A1866D18E379C0D4F.pdf; Supplier: LCSC; type: NPN; Current - Collector(Ic): 1.5A; Collector - Emitter Voltage VCEO: 25V; Pd - Power Dissipation: 300mW; DC Current Gain: 120@100mA,1.0V; Transition frequency(fT): 100MHz; Current - Collector Cutoff: 100nA; Vce Saturation(VCE(sat)): 500mV; Operating Temperature: -55℃~+150℃
R6 = 0603WAF4702T5E: 电阻类型:厚膜电阻;阻值:47kΩ;精度:±1%;功率:100mW;工作电压:75V;温度系数:±100ppm/℃;; LCSC Part Name: 47kΩ ±1% 100mW 厚膜电阻; Supplier Part: C25819; Manufacturer: UNI-ROYAL(厚声); Supplier Footprint: 0603; JLCPCB Part Class: Basic Part; Datasheet: https://item.szlcsc.com/datasheet/0603WAF4702T5E/26562.html; Supplier: LCSC; Type: 厚膜电阻; Tolerance: ±1%; Power(Watts): 100mW; Voltage-Supply(Max): 75V; Temperature Coefficient: ±100ppm/℃; Operating Temperature: -55℃~+155℃
R8 R27 = 0603WAF1002T5E: LCSC Part Name: 厚膜电阻 10kΩ ±1% 100mW; Supplier Part: C25804; Manufacturer: UNI-ROYAL(厚声); Supplier Footprint: 0603; JLCPCB Part Class: 基础库; Datasheet: https://atta.szlcsc.com/upload/public/pdf/source/20200306/C422600_1E6D84923E4A46A82E41ADD87F860B5C.pdf; Supplier: LCSC; Type: 厚膜电阻; Tolerance: ±1%; Power(Watts): 100mW; Overload Voltage (Max): 75V; Temperature Coefficient: ±100ppm/℃; Operating Temperature Range: -55℃~+155℃
R16 R17 = 0603WAF4701T5E: LCSC Part Name: 4.7kΩ ±1% 100mW 厚膜电阻; Supplier Part: C23162; Manufacturer: UNI-ROYAL(厚声); Supplier Footprint: 0603; JLCPCB Part Class: Basic Part; Datasheet: https://item.szlcsc.com/datasheet/0603WAF4701T5E/23889.html; Supplier: LCSC; Type: 厚膜电阻; Tolerance: ±1%; Power(Watts): 100mW; Voltage-Supply(Max): 75V; Temperature Coefficient: ±100ppm/℃; Operating Temperature: -55℃~+155℃
R34 R35 = 0603WAF5101T5E: LCSC Part Name: 5.1kΩ ±1% 100mW 厚膜电阻; Supplier Part: C23186; Manufacturer: UNI-ROYAL(厚声); Supplier Footprint: 0603; JLCPCB Part Class: Basic Part; Datasheet: https://item.szlcsc.com/datasheet/0603WAF5101T5E/23913.html; Supplier: LCSC; Type: 厚膜电阻; Tolerance: ±1%; Power(Watts): 100mW; Voltage-Supply(Max): 75V; Temperature Coefficient: ±100ppm/℃; Operating Temperature: -55℃~+155℃
R36 R37 = 0603WAF220JT5E: LCSC Part Name: 22Ω ±1% 100mW 厚膜电阻; Supplier Part: C23345; Manufacturer: UNI-ROYAL(厚声); Supplier Footprint: 0603; Datasheet: https://atta.szlcsc.com/upload/public/pdf/source/20200306/C422600_1E6D84923E4A46A82E41ADD87F860B5C.pdf; Supplier: LCSC; Type: 厚膜电阻; Tolerance: ±1%; Power(Watts): 100mW; Overload Voltage (Max): 75V; Temperature Coefficient: ±100ppm/℃; Operating Temperature Range: -55℃~+155℃
SW1 SW2 = TSA016A2518A: LCSC Part Name: 4.2*3.35*2.5mm 立贴 轻触开关; Supplier Part: C2888427; Manufacturer: BZCN(博众电气); Supplier Footprint: SMD; JLCPCB Part Class: 扩展库; Datasheet: https://atta.szlcsc.com/upload/public/pdf/source/20210906/0198B859780D4FA617E4EB862D7350E5.pdf; Supplier: LCSC; Contact Current: 50mA; Voltage Rating (DC): 12V; Mounting Style: 立贴; Actuator Style: 椭圆形按钮; Switch Length: 4.2mm; Switch Width: 3.35mm; Switch Height: 2.5mm
U15 = USB-TYPE-C-019: Supplier Part: C2927039; Manufacturer: DEALON(德艺隆); Supplier Footprint: 插件; JLCPCB Part Class: 扩展库; Supplier: LCSC
U26 = CH340K: LCSC Part Name: CH340K USB转串口芯片 CH340; Supplier Part: C968586; Manufacturer: WCH(南京沁恒); Supplier Footprint: ESOP-10-EP-150mil; JLCPCB Part Class: 扩展库; Datasheet: https://atta.szlcsc.com/upload/public/pdf/source/20200819/C84681_ADBED554CE321879DBD6B1D06488689C.pdf; Supplier: LCSC

## Nets
3V3: C1.2 C2.2 C3.2 C14.1 C15.1 C16.2 C41.2 C42.2 C43.2 C144.2 R2.2 R3.2 R4.2 R8.2 R23.2 R27.2 U1.2(3V3) U2.5(VDDIO) U2.8(VDD) U3.4(VREF) U4.2 U5.2 U7.4(VREF) U14.2(VOUT) U14.4(VOUT) U26.7(VCC) U26.10(V3)
5V: C9.1 C21.2 C22.2 C23.2 C25.1 C26.2 C47.1 CN1.1 CN4.4 CN5.4 CN6.3 CN7.4 CN8.1 D2.1 H1.3 H2.3 H4.1 H4.2 H4.3 H4.4 H5.3 L1.2 R9.2 U6.1 U14.3(VIN)
GND: C1.1 C2.1 C3.1 C4.1 C5.2 C6.1 C7.2 C8.1 C9.2 C14.2 C15.2 C16.1 C18.2 C19.1 C20.1 C22.1 C23.1 C25.2 C26.1 C27.1 C38.1 C41.1 C42.1 C43.1 C47.2 C144.1 CN1.4 CN4.2 CN5.2 CN6.4 CN7.2 CN8.2 H1.4 H2.4 H5.4 H6.1 H6.2 H6.3 H6.4 LED1.2(K) LED5.1(K) R6.1 R10.1 R34.1 R35.1 SW1.2 SW2.2 U1.1(GND) U1.40(GND) U1.41(GND) U2.1(SDO/SA0) U2.2(SDx) U2.3(SCx) U2.6(GND) U2.7(GND) U3.1(GND) U3.7(ISEN) U3.9(EP) U4.5 U5.5 U6.6 U7.1(GND) U7.7(ISEN) U7.9(EP) U13.1(AGND) U13.4(GND) U14.1(ADJ/GND) U15.1 U15.A1 U15.A12 U26.3(GND) U26.11(EP) U30.2
VBUS: D2.2 U15.A4 U15.A9
ADC1: C6.2 R5.1 R6.2 U1.15(IO3)
DTR: Q5.2(E) R17.1 U26.4(DTR#)
ECHO: CN1.3 U1.24(IO47)
GPIO0: C27.2 Q5.3(C) R27.1 SW1.1 U1.27(IO0)
GPIO1: U1.39(IO1)
GPIO2: U1.38(IO2)
GPIO4: U1.4(IO4) U6.2
GPIO5: U1.5(IO5) U6.3
GPIO6: U1.6(IO6) U6.4
GPIO7: U1.7(IO7) U6.5
GPIO8: U1.12(IO8)
GPIO9: U1.17(IO9) U7.2(IN2)
GPIO10: U1.18(IO10) U5.3
GPIO11: U1.19(IO11) U5.4
GPIO12: CN6.1 H1.1 H2.1 H5.1 R2.1 U1.20(IO12) U2.14(SDA)
GPIO13: CN6.2 H1.2 H2.2 H5.2 R3.1 U1.21(IO13) U2.13(SCL)
GPIO14: R1.1 U1.22(IO14)
GPIO15: U1.8(IO15) U3.3(IN1)
GPIO16: U1.9(IO16) U3.2(IN2)
GPIO17: U1.10(IO17) U4.3
GPIO18: U1.11(IO18) U4.4
GPIO19: U1.13(IO19)
GPIO20: U1.14(IO20)
GPIO21: CN1.2 U1.23(IO21)
GPIO35: H3.2 U1.28(IO35)
GPIO36: H3.1 U1.29(IO36)
GPIO37: CN4.3 U1.30(IO37)
GPIO38: CN4.1 U1.31(IO38)
GPIO39: CN5.3 U1.32(IO39)
GPIO40: CN5.1 U1.33(IO40)
GPIO41: CN7.3 U1.34(IO41)
GPIO42: CN7.1 U1.35(IO42)
GPIO45: H3.3 U1.26(IO45)
GPIO46: U1.16(IO46) U7.3(IN1)
GPIO48: H3.4 U1.25(IO48)
GPIORST: C38.2 Q4.3(C) R8.1 SW2.1 U1.3(EN)
GPIORX0: U1.36(RXD0) U26.8(TXD)
GPIOTX0: U1.37(TXD0) U26.9(RXD)
MP_BST: C24.1 U13.5(BST)
MP_EN/SYNC: R7.1 U13.6(EN/SYNC)
MP_FB: C21.1 R9.1 R10.2 U13.8(FB)
MP_SW: C24.2 L1.1 U13.3(SW)
RTS: Q4.2(E) R16.1 U26.6(RTS#)
USB_D+: R36.1 U15.A6 U15.B6
USB_D-: R37.1 U15.A7 U15.B7
VM: C4.2 C5.1 C7.1 C8.2 C19.2 C20.2 R5.2 R7.2 U3.5(VM) U7.5(VM) U13.2(IN) U16.1
$1N47: LED1.1(A) R1.2
$1N57: R4.1 U2.12(CS)
$1N85: CN2.2 U3.8(OUT2) U4.6
$1N86: CN2.1 U3.6(OUT1) U4.1
$1N109: CN3.1 U5.1 U7.6(OUT1)
$1N111: CN3.2 U5.6 U7.8(OUT2)
$1N348: U16.2 U16.3 U30.1
$1N360: C18.1 U13.7(VCC)
$1N369: LED5.2(A) R23.1
$2N49: Q5.1(B) R16.2
$2N51: Q4.1(B) R17.2
$2N56: R37.2 U26.2(UD-)
$2N57: R36.2 U26.1(UD+)
$2N60: R35.2 U15.B5
$2N64: R34.2 U15.A5

Not connected (* = marked no-connect by the designer): CN6 5* 6*; CN8 3* 4*; SCREW1 1*; SCREW2 1*; SCREW3 1*; SCREW4 1*; U2 4(INT1)* 9(INT2)* 10(NC)* 11(NC)*; U15 A8* B8*; U26 5(CTS#)*

## Notes on the sheets
sheet 1
- ESP32-S3-WROOM-1U
- 电机驱动（双驱）
- DCDC7.8V转5V
- 数据传输接口（包括超声波）
- 5V转3V3
- IIC设备
- 舵机设备
- 寻迹设备
sheet 2
- 电池电压检测电路
- （电阻精度1%）
  电池电压8.4V
  分压后2.6857V
  该电路有0.0574mA漏电流
- 自动烧录
